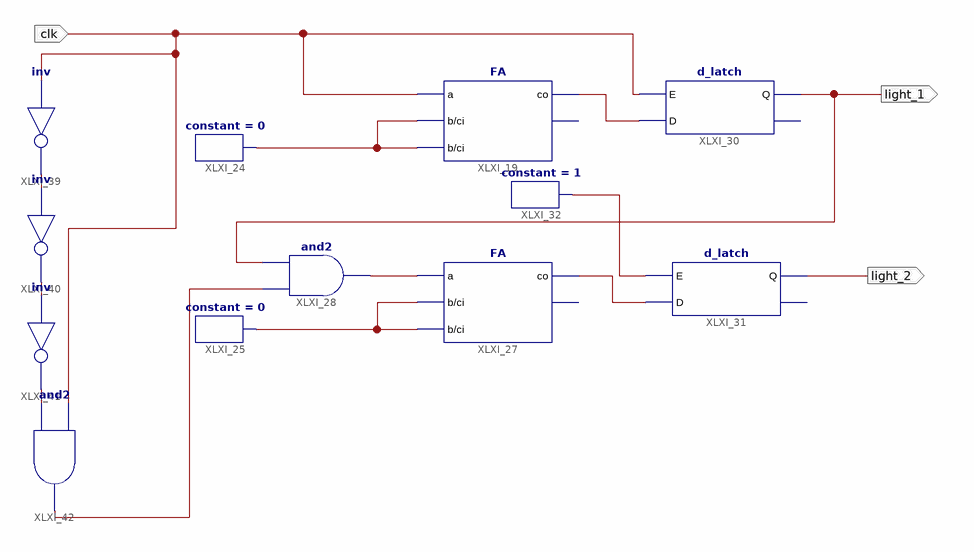
[diagram p0: schematic sheet 1]
// Xilinx ISE schematic schematic.sch (spartan3e) as structural Verilog: 12 symbols, 3 ports
module schematic (
  input  clk,
  output light_1,
  output light_2
);

  wire XLXN_24, XLXN_30, XLXN_31, XLXN_39, XLXN_40, XLXN_42, XLXN_50, XLXN_51, XLXN_52;

  FA XLXI_19 (.a(clk), .b(XLXN_24), .ci(XLXN_24), .co(XLXN_40));  // open: s
  constant #(.CValue("0")) XLXI_24 (.O(XLXN_24));
  constant #(.CValue("0")) XLXI_25 (.O(XLXN_30));
  FA XLXI_27 (.a(XLXN_31), .b(XLXN_30), .ci(XLXN_30), .co(XLXN_39));  // open: s
  and XLXI_28 (XLXN_31, clk, light_1);
  d_latch XLXI_30 (.E(clk), .D(XLXN_40), .Q(light_1));  // open: notQ
  d_latch XLXI_31 (.E(XLXN_42), .D(XLXN_39), .Q(light_2));  // open: notQ
  constant #(.CValue("1")) XLXI_32 (.O(XLXN_42));
  not XLXI_39 (XLXN_50, clk);
  not XLXI_40 (XLXN_51, XLXN_50);
  not XLXI_41 (XLXN_52, XLXN_51);
  and XLXI_42 (clk, XLXN_52, clk);
endmodule
